# EasyEDA Pro project RC Transmitter Mini.epro

# Schematic V2
Board Name: Board1; Create Date: 2025-03-20; Page Name: V2; Project Name: RC Transmitter V2; Schematic Name: V2; Update Date: 2025-03-20; Company: EasyEDA.com; Page Size: A4; Version: V1.0
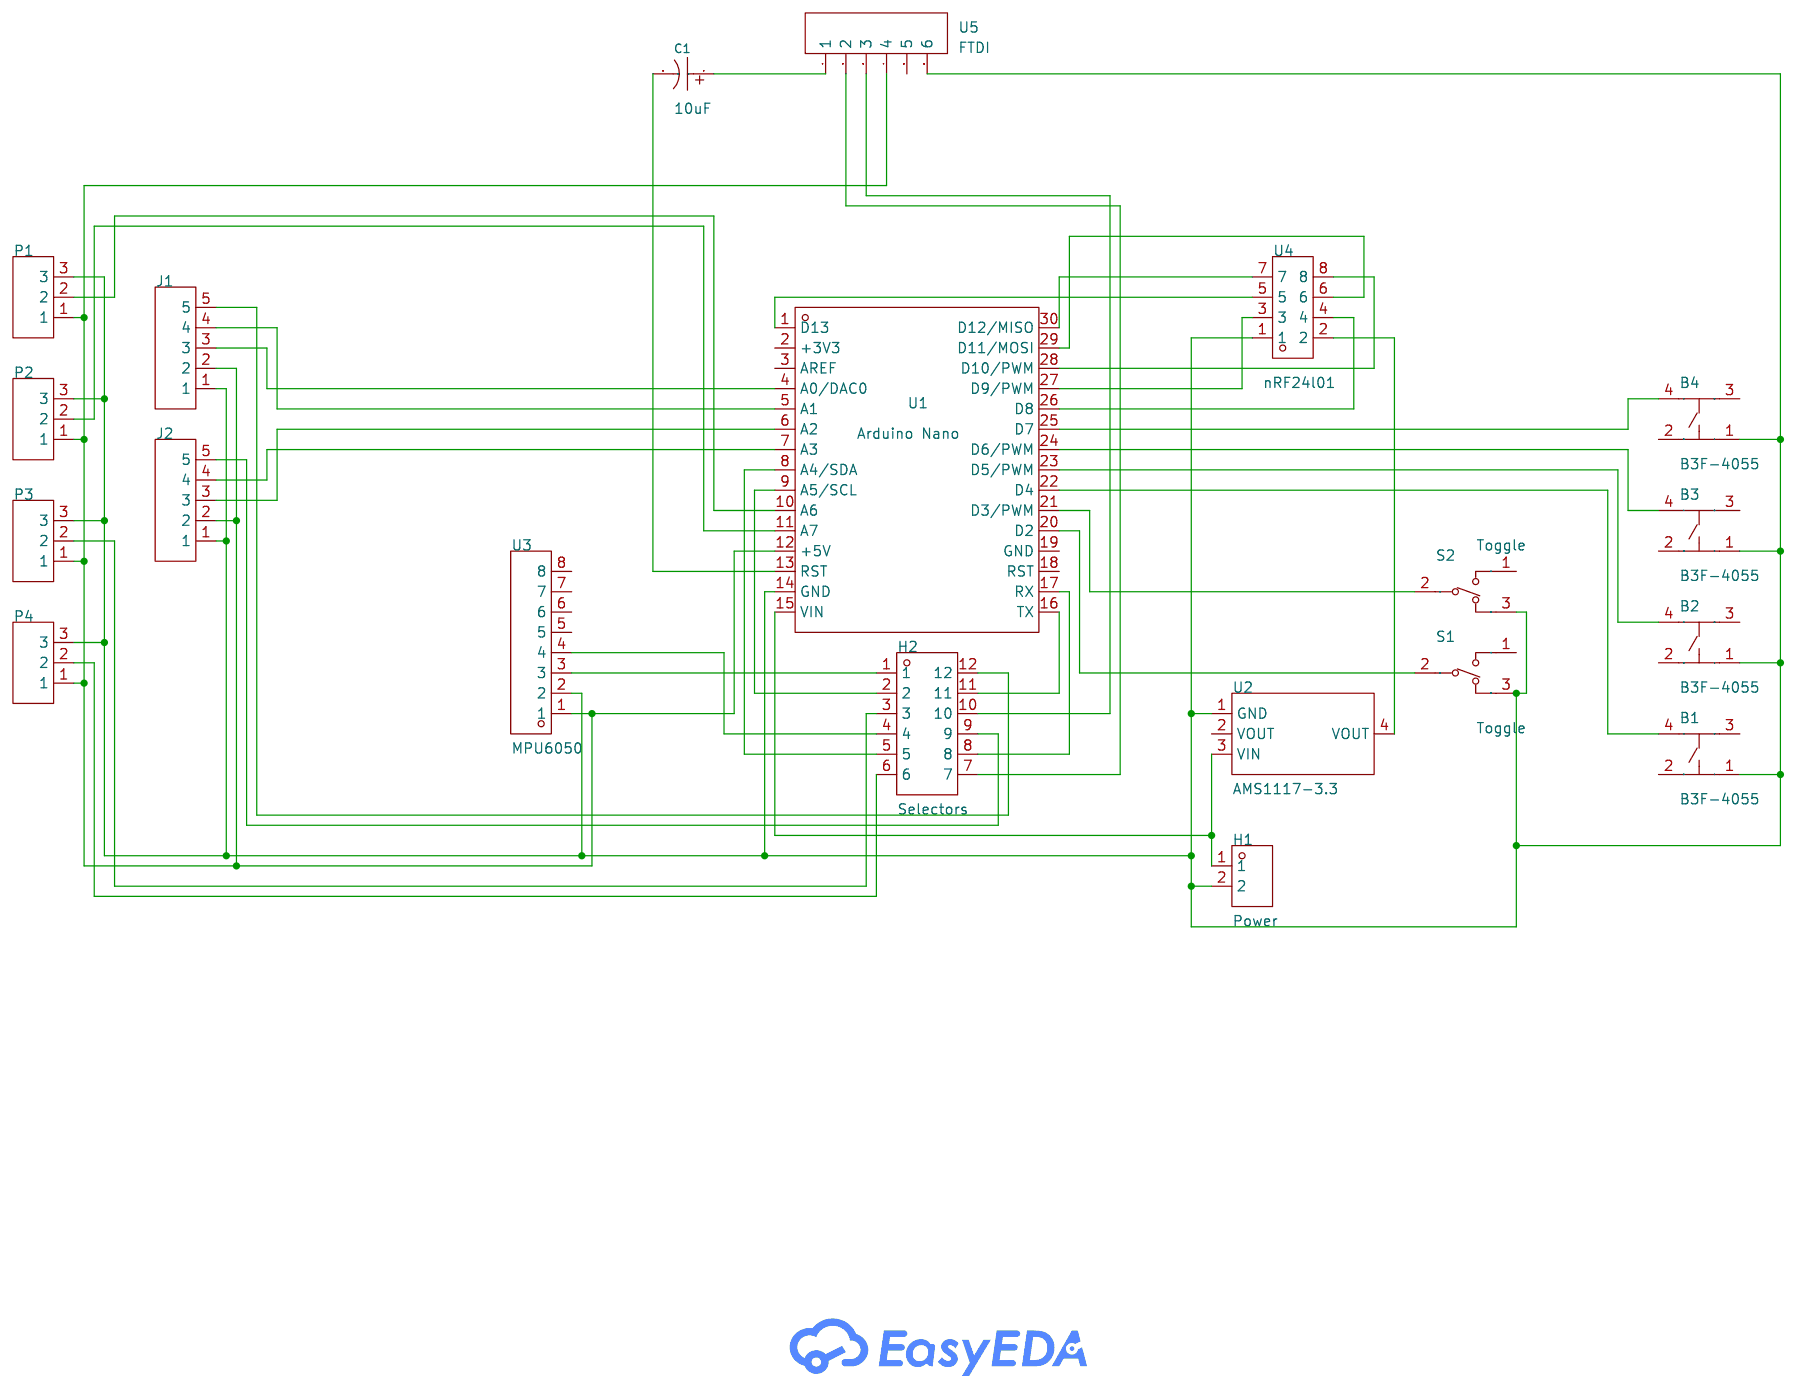
[diagram p0: schematic sheet]

## Parts
B1  B3F-4055  [KEY-TH_4P-L12.0-W12.0-P5.00-LS13.4-EH]
B2  B3F-4055  [KEY-TH_4P-L12.0-W12.0-P5.00-LS13.4-EH]
B3  B3F-4055  [KEY-TH_4P-L12.0-W12.0-P5.00-LS13.4-EH]
B4  B3F-4055  [KEY-TH_4P-L12.0-W12.0-P5.00-LS13.4-EH]
C1  10uF  [CAP-TH_BD5.0-P2.00-D0.8-FD]
H1  Power  [HDR-TH_2P-P2.54-V-M_5]
H2  Selectors  [HDR-TH_12P-P2.54-V-M-R3-C4-S2.54]
J1  HB-PH3-25415PB2GOP  [HDR-TH_5P-P2.54-V-M]
J2  HB-PH3-25415PB2GOP  [HDR-TH_5P-P2.54-V-M]
P1  PZ254V-11-03P  [HDR-TH_3P-P2.54-V-M]
P2  PZ254V-11-03P  [HDR-TH_3P-P2.54-V-M]
P3  PZ254V-11-03P  [HDR-TH_3P-P2.54-V-M]
P4  PZ254V-11-03P  [HDR-TH_3P-P2.54-V-M]
S1  Toggle  [SW-TH_ST-0-103-A01]
S2  Toggle  [SW-TH_ST-0-103-A01]
U1  Arduino Nano  [MOD-TH_ABX00028]
U2  AMS1117-3.3  [SOT-223-3_L6.5-W3.4-P2.30-LS7.0-BR]
U3  MPU6050  [HDR-TH_8P-P2.54-V-F]
U4  nRF24l01  [HDR-TH_8P-P2.54-V-F-R2-C4-S2.54]
U5  FTDI  [HDR-TH_6P-P2.54-V-M-1]

## Library data of the parts
B1-B4 = B3F-4055_C84931: Circuit:SPST Actuator Style:Rectangle button Mounting Style:Direct Insert Switch Length:12mm Switch Width:12mm Switch Height:7.3mm Contact Current:50mA Voltage Rating (DC):24V With Lamp:- Mechanical Life:-; LCSC Part Name: 12*12*7.3mm 直插 轻触开关; Supplier Part: C84931; Manufacturer: OMRON(欧姆龙); Supplier Footprint: 插件; JLCPCB Part Class: Extended Part; Datasheet: https://atta.szlcsc.com/upload/public/pdf/source/20170810/C93157_1502335414592880008.pdf; Supplier: LCSC; Circuit: SPST; Actuator Style: Rectangle button; Mounting Style: Direct Insert; Switch Length: 12mm; Switch Width: 12mm; Switch Height: 7.3mm; Contact Current: 50mA; Voltage Rating (DC): 24V
C1 = RD1H106M05011PC: Capacitance: Tolerance:±20% Tolerance:±20% Rated Voltage: Ripple Current:- Equivalent Series Resistance(ESR):- Lead Spacing: φD: L: Lifetime @ Temp:1000hrs@105℃; LCSC Part Name: 10uF ±20% 50V; Supplier Part: C160624; Manufacturer: SAMWHA(三和); Supplier Footprint: 插件,D5xL11mm; JLCPCB Part Class: Extended Part; Datasheet: https://atta.szlcsc.com/upload/public/pdf/source/20171212/C160624_15130639695151177990.pdf; Supplier: LCSC; Tolerance: ±20%; Lifetime @ Temp: 1000hrs@105℃
H1 = PZ254-1-02-Z-C: Pin Structure:1x2P Pitch:2.54mm Row Spacing:- Circluar Pins/Square Pins:Circular Pins Mounting Type:Straight Number of Rows:Plugin Number of Pins:2P Current Rating (Max):3A Length of Mating Pin:4.13mm Insulation Height:3mm Length of End Connection Pin:3mm; LCSC Part Name: 1x2P 间距:2.54mm 圆针 直插; Supplier Part: C5156429; Manufacturer: HCTL(华灿天禄); Supplier Footprint: 插件,P=2.54mm; JLCPCB Part Class: Extended Part; Datasheet: https://atta.szlcsc.com/upload/public/pdf/source/20230609/791AB95BE9F63E00E86E05F9E750B3EF.pdf; Supplier: LCSC; Pin Structure: 1x2P; Pitch: 2.54mm; Circluar Pins/Square Pins: Circular Pins; Mounting Type: Straight; Number of Rows: Plugin; Number of Pins: 2P; Current Rating (Max): 3A; Length of Mating Pin: 4.13mm; Insulation Height: 3mm; Length of End Connection Pin: 3mm; Contact Plating: Gold; Operating Temperature Range: -40℃~+105℃; Soldering Temperature(Max): 260℃@10S; Color: Black
H2 = HX PZ2.54-3x4P ZZ: Pin Structure:3x4P Pitch:2.54mm Row Spacing:2.54mm Circluar Pins/Square Pins:Policy Mounting Type:Direct Insert Number of Rows:Triple row Number of Pins:12P Current Rating (Max):3A Voltage Rating (Max):- Length of Mating Pin:6mm Insulation Height:2.5mm Le; LCSC Part Name: 3x4P 间距:2.54mm 方针 直插; Supplier Part: C32713291; Manufacturer: hanxia(韩下); Supplier Footprint: 插件,P=2.54mm; JLCPCB Part Class: Extended Part; Datasheet: https://atta.szlcsc.com/upload/public/pdf/source/20240723/03D5BD78F4265407C742BB8D20821E6B.pdf; Supplier: LCSC; Pin Structure: 3x4P; Pitch: 2.54mm; Row Spacing: 2.54mm; Circluar Pins/Square Pins: Policy; Mounting Type: Direct Insert; Number of Rows: Triple row; Number of Pins: 12P; Current Rating (Max): 3A; Length of Mating Pin: 6mm; Insulation Height: 2.5mm; Length of End Connection Pin: 3mm; Contact Material: Brass; Contact Plating: Gold; Operating Temperature Range: -40℃~+105℃; Color: Black
J1 J2 = HB-PH3-25415PB2GOP: Pin Structure:1x5P Pitch:2.54mm Row Spacing:2.54mm Circluar Pins/Square Pins:Policy Mounting Type:Straight Number of Rows:Single Row Number of Pins:5P Current Rating:3A Voltage Rating (Max):250V Length of Mating Pin:6mm Insulation Height:2.54mm Length of; LCSC Part Name: 1x5P 间距:2.54mm 方针 直插; Supplier Part: C6332198; Manufacturer: HANBO(汉博); Supplier Footprint: 插件,P=2.54mm; JLCPCB Part Class: Extended Part; Datasheet: https://atta.szlcsc.com/upload/public/pdf/source/20230803/F72D259687963761DF1B552F3BB84A31.pdf; Supplier: LCSC; Pin Structure: 1x5P; Pitch: 2.54mm; Row Spacing: 2.54mm; Circluar Pins/Square Pins: Policy; Mounting Type: Straight; Number of Rows: Single Row; Number of Pins: 5P; Current Rating: 3A; Voltage Rating (Max): 250V; Length of Mating Pin: 6mm; Insulation Height: 2.54mm; Length of End Connection Pin: 3mm; Contact Material: Brass; Contact Plating: Gold; Operating Temperature: -40℃~+105℃; Color: Black
P1-P4 = PZ254V-11-03P: Pin Structure:1x3P Pitch:2.54mm Row Spacing:- Circluar Pins/Square Pins:Policy Mounting Type:Straight Number of Rows:Single Row Number of Pins:3P Current Rating:3A Voltage Rating (Max):250V Length of Mating Pin:6mm Insulation Height:2.5mm Length of End Co; LCSC Part Name: 1x3P 间距:2.54mm 方针 直插; Supplier Part: C2937625; Manufacturer: XFCN(兴飞); Supplier Footprint: 插件,P=2.54mm; JLCPCB Part Class: Extended Part; Datasheet: https://atta.szlcsc.com/upload/public/pdf/source/20200309/C492402_8335C3D49C4E4C618838D59BB1D024C1.pdf; Supplier: LCSC; Pin Structure: 1x3P; Pitch: 2.54mm; Circluar Pins/Square Pins: Policy; Mounting Type: Straight; Number of Rows: Single Row; Number of Pins: 3P; Current Rating: 3A; Voltage Rating (Max): 250V; Length of Mating Pin: 6mm; Insulation Height: 2.5mm; Length of End Connection Pin: 3mm; Operating Temperature: -40℃~+105℃; Color: Black
S1 S2 = ST-0-103-A01-T000-RS: Circuit:Single Pole Double Throw (SPDT) Switch Length:8.3mm Switch Width:5.2mm Switch Height:23.6mm Mechanical Life:- Contact Current:3A Voltage Rating (AC):125V Actuator Type:Cylinder knob Pin Style:Solder Mounting Style:Direct Insert Operating Temperatu; LCSC Part Name: 超小型钮子三脚三档 五件套 含配件; Supplier Part: C1788488; Manufacturer: YUEN FUNG(源丰); Supplier Footprint: 插件; JLCPCB Part Class: Extended Part; Datasheet: https://atta.szlcsc.com/upload/public/pdf/source/20230720/34A1F41796E6F2C5E358D19C4AAA567D.pdf; Supplier: LCSC; Circuit: Single Pole Double Throw (SPDT); Switch Length: 8.3mm; Switch Width: 5.2mm; Switch Height: 23.6mm; Contact Current: 3A; Voltage Rating (AC): 125V; Actuator Type: Cylinder knob; Pin Style: Solder; Mounting Style: Direct Insert; Operating Temperature: -25℃~+85℃
U1 = ABX00028: Supplier Part: C21303176; Manufacturer: arduino; Datasheet: https://atta.szlcsc.com/upload/public/pdf/source/20240516/DBE20BC6A27351D8B1B352A6E0678D57.pdf; Supplier: LCSC
U2 = AMS1117-3.3_C6186: Output Type:Fixed Voltage - Supply:- Output Voltage:3.3V Output Voltage:3.3V Output Current:1A Power Supply Rejection Ratio (PSRR):72dB@(120Hz) Voltage Dropout:1.3V@(800mA) standby current:- Noise:- Features:Overcurrent Protection(OCP)；Thermal Protection(; LCSC Part Name: 输出3.3V 1A; Supplier Part: C6186; Manufacturer: AMS; Supplier Footprint: SOT-223; JLCPCB Part Class: Basic Part; Datasheet: https://atta.szlcsc.com/upload/public/pdf/source/20180727/C6186_7A095716F0823C02F1997A905E26C086.pdf; Supplier: LCSC; Output Type: Fixed; Output Voltage: 3.3V; Output Current: 1A; Power Supply Rejection Ratio (PSRR): 72dB@(120Hz); Voltage Dropout: 1.3V@(800mA); Features: Overcurrent Protection(OCP)；Thermal Protection(TSD); Output Configuration: Positive electrode; Number of Outputs: 1
U3 = KH-2.54FH-1X8P-H8.5: Holes Structure:1x8P Pitch:2.54mm Row Spacing:- Circular Hole / Square Hole:Square Holes Mounting Type:Straight Number of Rows:Plugin Number of Holes:8P Current Rating (Max):3A Voltage Rating (Max):- Holes Direction:Top Insulation Height:8.5mm Operating T; LCSC Part Name: 间距:2.54mm 1x8P 直插; Supplier Part: C2905417; Manufacturer: kinghelm(金航标); Supplier Footprint: 插件,P=2.54mm; JLCPCB Part Class: Extended Part; Datasheet: https://atta.szlcsc.com/upload/public/pdf/source/20211019/4EE60A4A588681C04A5AE3F1D2563204.pdf; Supplier: LCSC; Holes Structure: 1x8P; Pitch: 2.54mm; Circular Hole / Square Hole: Square Holes; Mounting Type: Straight; Number of Rows: Plugin; Number of Holes: 8P; Current Rating (Max): 3A; Holes Direction: Top; Insulation Height: 8.5mm; Operating Temperature Range: -40℃~+105℃
U4 = 2.54-2*4: Holes Structure:2x4P Pitch:2.54mm Row Spacing:2.54mm Circular Hole / Square Hole:Square Holes Mounting Type:Straight Number of Rows:双排 Number of Holes:8P Current Rating (Max):2.5A Voltage Rating (Max):- Holes Direction:Top Insulation Height:8.5mm Operatin; LCSC Part Name: 间距:2.54mm 2x4P 直插; Supplier Part: C2977588; Manufacturer: ZHOURI(洲日); Supplier Footprint: 插件,P=2.54mm; JLCPCB Part Class: Extended Part; Datasheet: https://atta.szlcsc.com/upload/public/pdf/source/20220328/363EB391BC0EB759CF231FC910753CBE.pdf; Supplier: LCSC; Holes Structure: 2x4P; Pitch: 2.54mm; Row Spacing: 2.54mm; Circular Hole / Square Hole: Square Holes; Mounting Type: Straight; Number of Rows: 双排; Number of Holes: 8P; Current Rating (Max): 2.5A; Holes Direction: Top; Insulation Height: 8.5mm; Operating Temperature Range: -40℃~+105℃
U5 = 2.54-1x6P直针: Pin Structure:1x6P Pitch:2.54mm Row Spacing:- Circluar Pins/Square Pins:Square Pins Mounting Type:Straight Number of Rows:Plugin Number of Pins:6P Current Rating (Max):3A Voltage Rating (Max):- Length of Mating Pin:- Insulation Height:- Contact Material:; LCSC Part Name: 间距:2.54mm 1x6P 直插 方针; Supplier Part: C37208; Manufacturer: BOOMELE(博穆精密); Supplier Footprint: 插件,P=2.54mm; JLCPCB Part Class: Extended Part; Supplier: LCSC; Pin Structure: 1x6P; Pitch: 2.54mm; Circluar Pins/Square Pins: Square Pins; Mounting Type: Straight; Number of Rows: Plugin; Number of Pins: 6P; Current Rating (Max): 3A; Operating Temperature Range: -40℃~+105℃; Color: Black

## Nets
Net-(B1-1): B1.1 B2.1 B3.1 B4.1 H1.2 J1.1 J2.1 P1.3 P2.3 P3.3 P4.3 S1.3 S2.3 U1.14(GND) U2.1(GND) U3.2 U4.1 U5.6
Net-(B1-4): B1.4 U1.22(D4)
Net-(B2-4): B2.4 U1.23(D5/PWM)
Net-(B3-4): B3.4 U1.24(D6/PWM)
Net-(B4-4): B4.4 U1.25(D7)
Net-(C1-1): C1.1 U5.1
Net-(C1-2): C1.2 U1.13(RST)
Net-(H1-1): H1.1 U1.15(VIN) U2.3(VIN)
Net-(H2-1): H2.1 U3.3
Net-(H2-2): H2.2 U1.9(A5/SCL)
Net-(H2-3): H2.3 P3.2
Net-(H2-4): H2.4 U3.4
Net-(H2-5): H2.5 U1.8(A4/SDA)
Net-(H2-6): H2.6 P4.2
Net-(H2-7): H2.7 U5.2
Net-(H2-8): H2.8 U1.17(RX)
Net-(H2-9): H2.9 J2.5
Net-(H2-10): H2.10 U5.3
Net-(H2-11): H2.11 U1.16(TX)
Net-(H2-12): H2.12 J1.5
Net-(J1-2): J1.2 J2.2 P1.1 P2.1 P3.1 P4.1 U1.12(+5V) U3.1 U5.4
Net-(J1-3): J1.3 U1.4(A0/DAC0)
Net-(J1-4): J1.4 U1.5(A1)
Net-(J2-3): J2.3 U1.6(A2)
Net-(J2-4): J2.4 U1.7(A3)
Net-(P1-2): P1.2 U1.10(A6)
Net-(P2-2): P2.2 U1.11(A7)
Net-(S1-2): S1.2 U1.20(D2)
Net-(S2-2): S2.2 U1.21(D3/PWM)
Net-(U1-1): U1.1(D13) U4.5
Net-(U1-26): U1.26(D8) U4.4
Net-(U1-27): U1.27(D9/PWM) U4.3
Net-(U1-28): U1.28(D10/PWM) U4.8
Net-(U1-29): U1.29(D11/MOSI) U4.6
Net-(U1-30): U1.30(D12/MISO) U4.7
Net-(U2-4): U2.4(VOUT) U4.2

Not connected (* = marked no-connect by the designer): B1 2 3; B2 2 3; B3 2 3; B4 2 3; S1 1; S2 1; U1 2(+3V3) 3(AREF) 18(RST) 19(GND); U2 2(VOUT); U3 5 6 7 8; U5 5

# Board PCB
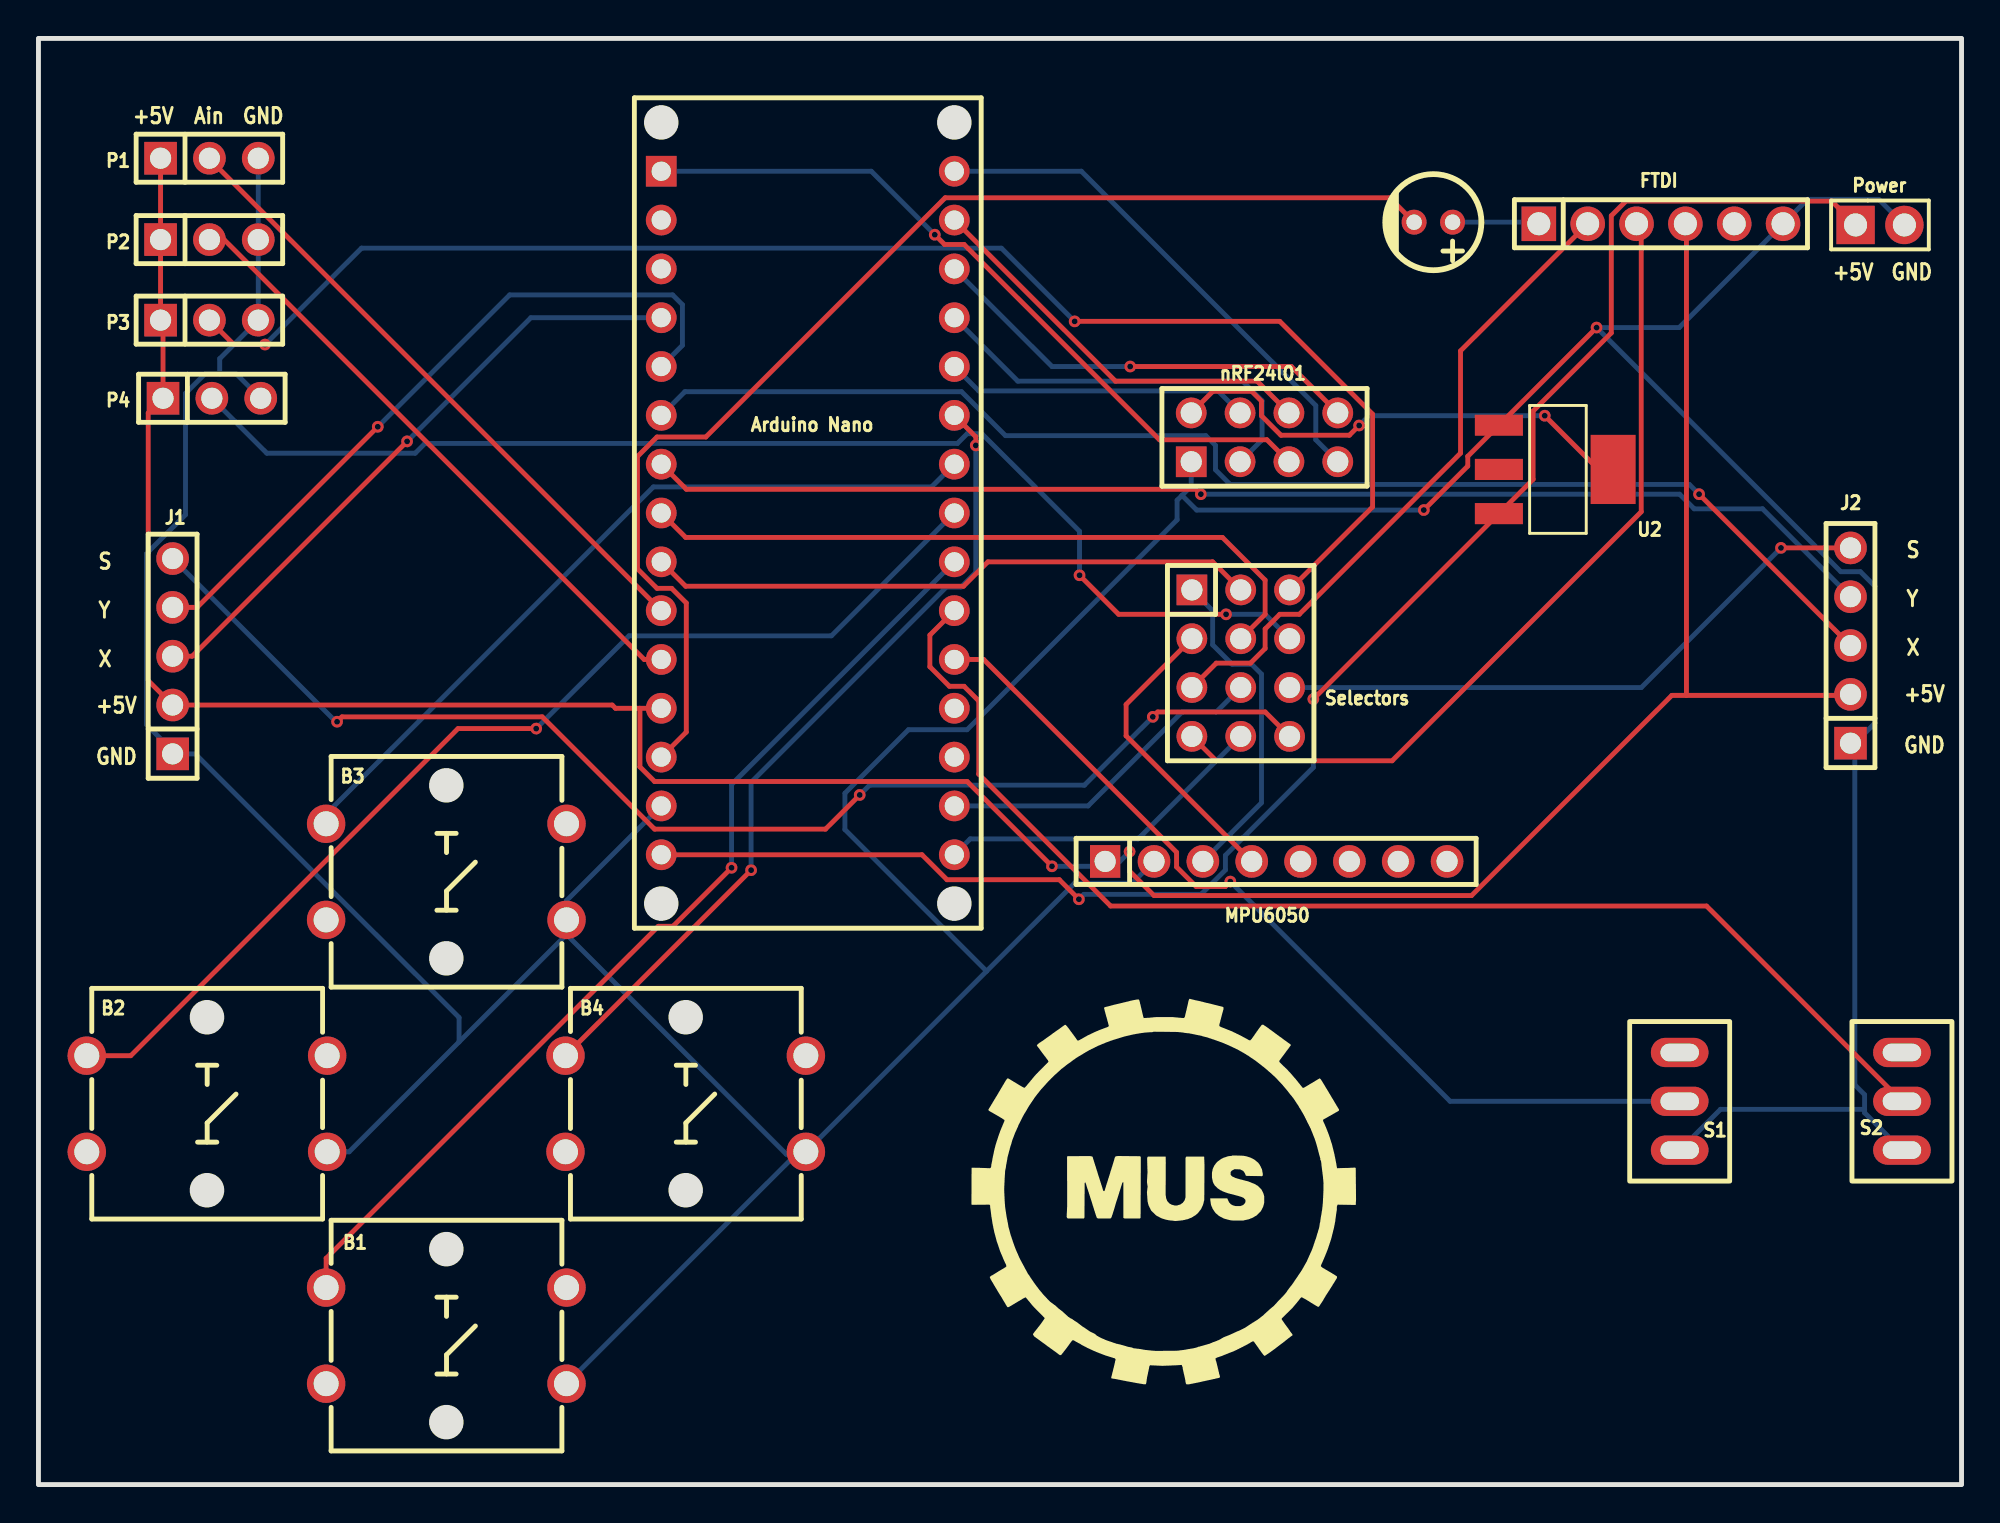
[diagram p1: board, top side]
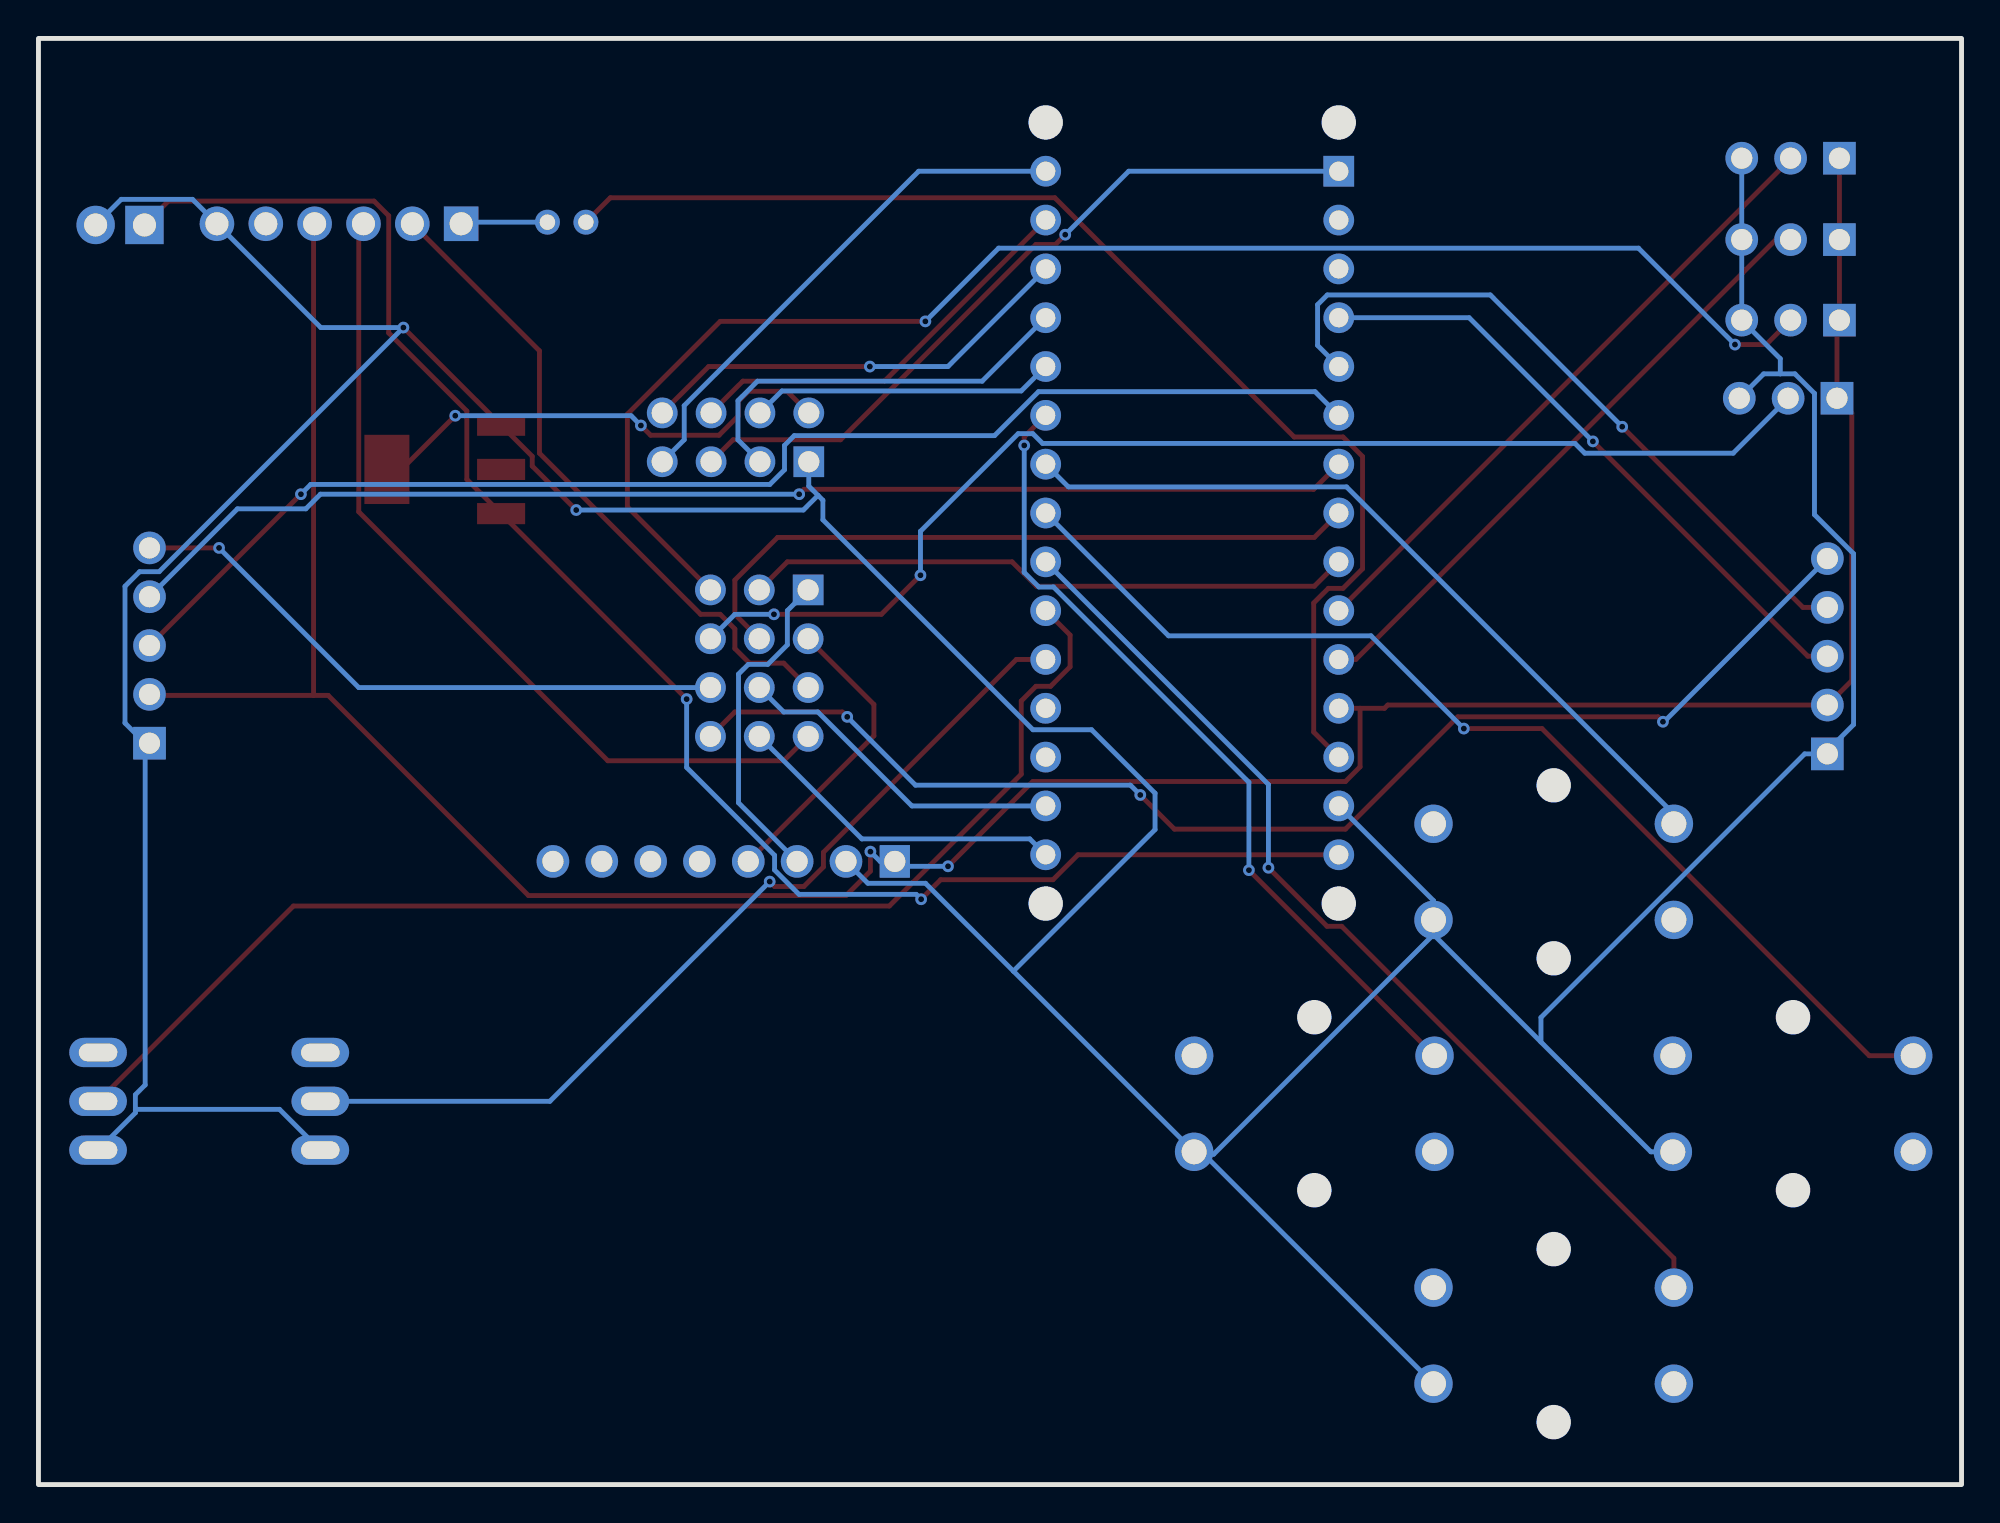
[diagram p2: board, bottom side, seen from below]

Outline 100 x 75.23 mm; copper layers: Top Layer, Bottom Layer. Coordinates in mm from the lower left corner of the outline.
Outline path: rectangle 0,75.23 100,0
Stack: Top Layer 0.035mm / Dielectric1 1.51mm FR4 er 4.5 / Bottom Layer 0.035mm

## Design rules (mm)
template: JLCPCB Capability(Two Layers Board)
spacing copperThickness1oz (default): track to track 0.102, other pairs 0.152 to 0.3
spacing copperThickness2oz: track to track 0.203, other pairs 0.152 to 0.3
track width copperThickness1oz (default): min 0.127, default 0.254, max 2.54
track width copperThickness2oz: min 0.203, default 0.254, max 2.54
differential pair differentialPair (default): width min 0.127, default 0.254, max 2.54; gap min 0.152, default 0.152
via viaSize (default): diameter min 0.5, default 0.61, max 10; hole min 0.3, default 0.305, max 6.3

## Placement (name value [footprint] x y rotation side)
Arduino Nano  Arduino Nano  [MOD-TH_ABX00028]  40 50.55 0 top
B1  B3F-4055  [KEY-TH_4P-L12.0-W12.0-P5.00-LS13.4-EH]  21.21 7.75 0 top
B2  B3F-4055  [KEY-TH_4P-L12.0-W12.0-P5.00-LS13.4-EH]  8.76 19.81 0 top
B3  B3F-4055  [KEY-TH_4P-L12.0-W12.0-P5.00-LS13.4-EH]  21.21 31.88 0 top
B4  B3F-4055  [KEY-TH_4P-L12.0-W12.0-P5.00-LS13.4-EH]  33.66 19.81 0 top
C1  10uF  [CAP-TH_BD5.0-P2.00-D0.8-FD]  72.53 65.68 180 top
FTDI  FTDI  [HDR-TH_6P-P2.54-V-M-1]  84.37 65.59 0 top
J1  HB-PH3-25415PB2GOP  [HDR-TH_5P-P2.54-V-M]  6.98 43.09 90 top
J2  HB-PH3-25415PB2GOP  [HDR-TH_5P-P2.54-V-M]  94.23 43.65 90 top
MPU6050  MPU6050  [HDR-TH_8P-P2.54-V-F]  64.36 32.42 0 top
nRF24l01  nRF24l01  [HDR-TH_8P-P2.54-V-F-R2-C4-S2.54]  63.75 54.48 0 top
P1  PZ254V-11-03P  [HDR-TH_3P-P2.54-V-M]  8.89 69 0 top
P2  PZ254V-11-03P  [HDR-TH_3P-P2.54-V-M]  8.89 64.77 0 top
P3  PZ254V-11-03P  [HDR-TH_3P-P2.54-V-M]  8.89 60.58 0 top
P4  PZ254V-11-03P  [HDR-TH_3P-P2.54-V-M]  9.02 56.52 0 top
Power  Power  [HDR-TH_2P-P2.54-V-M_5]  95.76 65.53 0 top
S1  Toggle  [SW-TH_ST-0-103-A01]  85.34 19.94 270 top
S2  Toggle  [SW-TH_ST-0-103-A01]  96.9 19.94 270 top
Selectors  Selectors  [HDR-TH_12P-P2.54-V-M-R3-C4-S2.54]  62.52 42.73 270 top
U2  AMS1117-3.3  [SOT-223-3_L6.5-W3.4-P2.30-LS7.0-BR]  78.91 52.81 180 top

## Footprints (pads in the part's own frame, mm; a bottom-side part is the same pattern mirrored in y, then rotated)
CAP-TH_BD5.0-P2.00-D0.8-FD
  round 1.3 hole 0.8: 1(-1,0) 2(1,0)
HDR-TH_2P-P2.54-V-M_5
  rect 2x2 hole 1.2: 1(-1.27,0)
  round 2 hole 1.2: 2(1.27,0)
HDR-TH_3P-P2.54-V-M
  rect 1.7x1.7 hole 1.1: 1(-2.54,0)
  round 1.7 hole 1.1: 2(0,0) 3(2.54,0)
HDR-TH_5P-P2.54-V-M
  rect 1.7x1.7 hole 1.1: 1(-5.08,0)
  round 1.7 hole 1.1: 2(-2.54,0) 3(0,0) 4(2.54,0) 5(5.08,0)
HDR-TH_6P-P2.54-V-M-1
  rect 1.8x1.8 hole 1.2: 1(-6.35,0)
  round 1.8 hole 1.2: 2(-3.81,0) 3(-1.27,0) 4(1.27,0) 5(3.81,0) 6(6.35,0)
HDR-TH_8P-P2.54-V-F
  rect 1.575x1.7 hole 1.1: 1(-8.89,0)
  round 1.7 hole 1.1: 2(-6.35,0) 3(-3.81,0) 4(-1.27,0) 5(1.27,0) 6(3.81,0) 7(6.35,0) 8(8.89,0)
HDR-TH_8P-P2.54-V-F-R2-C4-S2.54
  rect 1.6x1.6 hole 1.1: 1(-3.81,-1.27)
  round 1.6 hole 1.1: 2(-3.81,1.27) 3(-1.27,-1.27) 4(-1.27,1.27) 5(1.27,-1.27) 6(1.27,1.27) 7(3.81,-1.27) 8(3.81,1.27)
HDR-TH_12P-P2.54-V-M-R3-C4-S2.54
  rect 1.6x1.6 hole 1.1: 1(-3.81,-2.54)
  round 1.6 hole 1.1: 2(-3.81,0) 3(-3.81,2.54) 4(-1.27,-2.54) 5(-1.27,0) 6(-1.27,2.54) 7(1.27,-2.54) 8(1.27,0) 9(1.27,2.54) 10(3.81,-2.54) 11(3.81,0) 12(3.81,2.54)
KEY-TH_4P-L12.0-W12.0-P5.00-LS13.4-EH
  round 2 hole 1.3: 1(6.25,-2.5) 2(-6.25,-2.5) 3(6.25,2.5) 4(-6.25,2.5)
MOD-TH_ABX00028
  rect 1.6x1.6 hole 1: 1(-7.62,17.78)
  round 1.6 hole 1: 2(-7.62,15.24) 3(-7.62,12.7) 4(-7.62,10.16) 5(-7.62,7.62) 6(-7.62,5.08) 7(-7.62,2.54) 8(-7.62,0) 9(-7.62,-2.54) 10(-7.62,-5.08) 11(-7.62,-7.62) 12(-7.62,-10.16) 13(-7.62,-12.7) 14(-7.62,-15.24) 15(-7.62,-17.78) 16(7.62,-17.78) 17(7.62,-15.24) 18(7.62,-12.7) 19(7.62,-10.16) 20(7.62,-7.62) 21(7.62,-5.08) 22(7.62,-2.54) 23(7.62,0) 24(7.62,2.54) 25(7.62,5.08) 26(7.62,7.62) 27(7.62,10.16) 28(7.62,12.7) 29(7.62,15.24) 30(7.62,17.78)
SOT-223-3_L6.5-W3.4-P2.30-LS7.0-BR
  rect 2.5x1.1 smd: 1(2.97,-2.3) 2(2.97,0) 3(2.97,2.3)
  rect 2.34x3.6 smd: 4(-2.97,0)
SW-TH_ST-0-103-A01
  oval 1.524x3 hole 0.914x2: 1(-2.54,0) 2(0,0) 3(2.54,0)

## Nets
$1N1105: Arduino Nano.15 Power.1 U2.3
$1N1106: nRF24l01.2 U2.4
$1N1107: Arduino Nano.26 nRF24l01.4
$1N1108: Arduino Nano.16 Selectors.11
$1N1109: Arduino Nano.17 Selectors.8
$1N1110: Arduino Nano.9 Selectors.2
$1N1111: Arduino Nano.8 Selectors.5
$1N1112: MPU6050.3 Selectors.1
$1N1113: MPU6050.4 Selectors.4
$1N1115: Arduino Nano.4 J1.3
$1N1116: Arduino Nano.5 J1.4
$1N1117: Arduino Nano.6 J2.3
$1N1118: Arduino Nano.7 J2.4
$1N1119: J2.5 Selectors.9
$1N1120: J1.5 Selectors.12
$1N1121: Arduino Nano.20 S1.2
$1N1122: Arduino Nano.21 S2.2
$1N1124: Arduino Nano.10 P1.2
$1N1125: Arduino Nano.11 P2.2
$1N1126: P4.2 Selectors.6
$1N1127: P3.2 Selectors.3
$1N1129: Arduino Nano.1 nRF24l01.5
$1N1130: Arduino Nano.27 nRF24l01.3
$1N1131: Arduino Nano.30 nRF24l01.7
$1N1132: Arduino Nano.29 nRF24l01.6
$1N1133: Arduino Nano.28 nRF24l01.8
$1N1134: Arduino Nano.25 B4.4
$1N1135: Arduino Nano.24 B3.4
$1N1136: Arduino Nano.23 B2.4
$1N1137: Arduino Nano.22 B1.4
$1N1138: C1.1 FTDI.1
$1N1139: Arduino Nano.13 C1.2
$1N1140: FTDI.3 Selectors.10
$1N1141: FTDI.2 Selectors.7
$1N2204: Arduino Nano.14 B1.1 B2.1 B3.1 B4.1 FTDI.6 J1.1 J2.1 MPU6050.2 nRF24l01.1 P1.3 P2.3 P3.3 P4.3 Power.2 S1.3 S2.3 U2.1
$1N2235: Arduino Nano.12 FTDI.4 J1.2 J2.2 MPU6050.1 P1.1 P2.1 P3.1 P4.1

Pads without a net: Arduino Nano 2 3 18 19; B1 2 3; B2 2 3; B3 2 3; B4 2 3; FTDI 5; MPU6050 5 6 7 8; S1 1; S2 1; U2 2

## Via types
v1: diameter 0.61, hole 0.305, Top Layer to Bottom Layer, 27 vias

## Routing (per net, layer and track width the routed paths; a pad name or vN(x,y) marks a point on that pad's centre or on a via; arc(x,y) is an arc through that point)
$1N1105: length 86.8
  Top Layer w0.254: v1(66.29,40.86) U2.3 77.72,52.3 77.72,55.85 81.79,59.92 81.79,66.01 82.55,66.77 93.25,66.77 Power.1 ; v1(54.1,30.45) 53.09,31.47 47.24,31.47 45.94,32.77 Arduino Nano.15
  Bottom Layer w0.254: v1(54.1,30.45) 54.36,30.7 60.45,30.7 61.72,31.97 61.72,32.74 66.29,37.31 v1(66.29,40.86)
$1N1106: length 25.4
  Top Layer w0.254: nRF24l01.2 61.07,56.88 63.09,56.88 63.59,56.37 63.59,55.61 64.61,54.59 68.17,54.59 v1(68.67,55.1) ; v1(78.33,55.61) 81.12,52.81 U2.4
  Bottom Layer w0.254: v1(68.67,55.1) 69.18,55.61 v1(78.33,55.61)
$1N1107: length 15.9
  Bottom Layer w0.254: Arduino Nano.26 48.9,56.9 61.34,56.9 nRF24l01.4
$1N1108: length 17.4
  Bottom Layer w0.254: Arduino Nano.16 48.45,33.59 57.18,33.59 Selectors.11
$1N1109: length 17.4
  Bottom Layer w0.254: Selectors.8 61.25,40.19 59.47,40.19 54.58,35.31 Arduino Nano.17
$1N1110: length 31.8
  Top Layer w0.254: Arduino Nano.9 33.66,46.74 48.1,46.74 49.37,48.01 61.06,48.01 Selectors.2
$1N1111: length 36.4
  Top Layer w0.254: Arduino Nano.8 33.66,49.28 61.56,49.28 63.79,47.05 63.79,45.28 Selectors.5
$1N1112: length 17.5
  Bottom Layer w0.254: MPU6050.3 63.6,35.47 63.6,42.16 63.09,42.67 62.07,42.67 61.06,43.69 61.06,45.47 Selectors.1
$1N1113: length 15.7
  Top Layer w0.254: Selectors.4 56.56,40.58 56.56,38.95 MPU6050.4
$1N1115: length 32.7
  Top Layer w0.254: v1(19.17,54.27) 7.99,43.09 J1.3
  Bottom Layer w0.254: v1(19.17,54.27) 25.6,60.71 Arduino Nano.4
$1N1116: length 37.1
  Top Layer w0.254: v1(17.64,55.03) 8.25,45.64 J1.4
  Bottom Layer w0.254: Arduino Nano.5 33.49,59.27 33.49,61.38 32.98,61.89 24.5,61.89 v1(17.64,55.03)
$1N1117: length 68.6
  Top Layer w0.254: J2.3 v1(86.35,51.52)
  Bottom Layer w0.254: Arduino Nano.6 33.62,56.86 48,56.86 50.28,54.57 60.7,54.57 61.21,54.06 61.21,52.79 61.97,52.03 85.84,52.03 v1(86.35,51.52)
$1N1118: length 64.7
  Top Layer w0.254: Arduino Nano.7 33.69,51.78 60.19,51.78 v1(60.44,51.52)
  Bottom Layer w0.254: J2.4 89.65,50.76 86.1,50.76 85.34,51.52 v1(60.44,51.52)
$1N1119: length 32.2
  Top Layer w0.254: v1(90.61,48.73) J2.5
  Bottom Layer w0.254: v1(90.61,48.73) 83.35,41.47 Selectors.9
$1N1120: length 67.2
  Top Layer w0.254: Selectors.12 63.79,40.19 58.2,40.19 v1(57.95,39.94) ; v1(42.71,35.88) 40.93,34.1 32.04,34.1 26.2,39.94 15.78,39.94 v1(15.53,39.69)
  Bottom Layer w0.254: J1.5 15.46,39.69 v1(15.53,39.69) ; v1(42.71,35.88) 43.21,36.39 54.39,36.39 v1(57.95,39.94)
$1N1121: length 47.9
  Top Layer w0.254: v1(61.98,31.37) 61.72,31.11 60.2,31.11 59.18,32.13 59.18,32.89 49.15,42.93 Arduino Nano.20
  Bottom Layer w0.254: v1(61.98,31.37) 73.41,19.94 S1.2
$1N1122: length 65.6
  Top Layer w0.254: Arduino Nano.21 46.35,44.2 46.35,42.55 47.37,41.53 48.13,41.53 48.9,40.77 48.9,36.96 55.75,30.1 86.74,30.1 S2.2
$1N1124: length 33.3
  Top Layer w0.254: P1.2 8.89,68.96 Arduino Nano.10
$1N1125: length 32.5
  Top Layer w0.254: P2.2 9.65,64.77 31.5,42.93 Arduino Nano.11
$1N1126: length 63.4
  Top Layer w0.254: v1(54.14,47.31) 56.17,45.28 v1(61.76,45.28)
  Bottom Layer w0.254: Selectors.6 63.79,45.28 v1(61.76,45.28) ; v1(54.14,47.31) 54.14,49.59 49.06,54.67 48.29,54.67 47.79,54.17 20.1,54.17 19.59,53.66 11.88,53.66 P4.2
$1N1127: length 77.6
  Top Layer w0.254: v1(53.88,60.52) 64.55,60.52 69.38,55.69 69.38,50.86 Selectors.3 ; P3.2 10.16,59.31 v1(11.78,59.31)
  Bottom Layer w0.254: v1(11.78,59.31) 16.8,64.33 50.07,64.33 v1(53.88,60.52)
$1N1129: length 38.9
  Top Layer w0.254: 65.02,53.21 63.88,54.36 58.29,54.36 48.13,64.52 47.12,64.52 v1(46.61,65.02)
  Bottom Layer w0.254: v1(46.61,65.02) 43.31,68.33 Arduino Nano.1
$1N1130: length 21.4
  Bottom Layer w0.254: Arduino Nano.27 50.93,57.4 62.61,57.4 63.63,56.39 63.63,54.36 62.48,53.21
$1N1131: length 27.2
  Bottom Layer w0.254: 67.56,53.21 66.42,54.36 66.42,56.13 54.23,68.33 Arduino Nano.30
$1N1132: length 21.6
  Top Layer w0.254: Arduino Nano.29 56.01,57.4 63.37,57.4 nRF24l01.6
$1N1133: length 23
  Top Layer w0.254: v1(56.77,58.17) 65.15,58.17 nRF24l01.8
  Bottom Layer w0.254: Arduino Nano.28 52.71,58.17 v1(56.77,58.17)
$1N1134: length 43.1
  Top Layer w0.254: v1(48.74,54.06) 48.74,54.51 Arduino Nano.25 ; B4.4 v1(37.06,31.96)
  Bottom Layer w0.254: v1(48.74,54.06) 48.74,47.46 47.98,46.7 47.22,46.7 37.06,36.54 v1(37.06,31.96)
$1N1135: length 40.7
  Bottom Layer w0.254: Arduino Nano.24 46.44,51.9 31.98,51.9 14.96,34.89 B3.4
$1N1136: length 56.8
  Top Layer w0.254: v1(25.88,39.33) 21.82,39.33 4.8,22.31 B2.4
  Bottom Layer w0.254: Arduino Nano.23 41.24,44.16 30.71,44.16 v1(25.88,39.33)
$1N1137: length 51.7
  Top Layer w0.254: v1(36.04,32.09) 32.99,29.04 32.23,29.04 14.96,11.77 B1.4
  Bottom Layer w0.254: v1(36.04,32.09) 36.04,36.42 Arduino Nano.22
$1N1138: length 4.5
  Bottom Layer w0.254: FTDI.1 77.94,65.68 C1.1
$1N1139: length 64.2
  Top Layer w0.254: C1.2 70.26,66.95 47.15,66.95 34.7,54.5 32.16,54.5 31.15,53.48 31.15,47.64 32.16,46.63 32.93,46.63 33.69,45.86 33.69,39.15 Arduino Nano.13
$1N1140: length 44.3
  Top Layer w0.254: Selectors.10 61.25,37.66 70.39,37.66 83.35,50.61 83.35,65.35 FTDI.3
$1N1141: length 34.3
  Top Layer w0.254: Selectors.7 61.25,42.73 63.03,42.73 63.79,43.5 63.79,44.51 64.55,45.28 65.57,45.28 73.95,53.66 73.95,58.98 FTDI.2
$1N2204: length 289.1
  Top Layer w0.254: v1(72.04,50.7) 74.32,52.99 74.32,53.49 U2.1 v1(81.02,60.19)
  Bottom Layer w0.254: MPU6050.2 56.87,31.28 53.88,31.28 49.3,26.71 ; 94.96,19.52 87.47,19.52 85.34,17.4 ; 94.96,19.52 94.96,19.34 96.9,17.4 ; 94.96,19.52 94.96,20.28 94.45,20.79 94.45,38.57 ; 49.3,26.71 41.94,34.08 41.94,35.97 45.24,39.27 48.29,39.27 59.21,50.19 59.21,51.21 59.46,51.46 ; 49.3,26.71 B4.1 39.78,17.19 39.4,17.19 ; 27.46,28.61 38.89,17.19 39.4,17.19 ; 27.46,28.61 21.87,23.03 ; 27.46,28.61 B3.1 27.46,30.38 Arduino Nano.14 ; 7.14,38.01 8.16,38.01 21.87,24.3 21.87,23.03 ; 7.14,38.01 5.61,39.54 5.61,48.43 7.65,50.46 7.65,56.77 8.66,57.78 9.42,57.78 ; 7.14,38.01 J1.1 ; 9.42,57.78 9.42,58.57 P3.3 P2.3 P1.3 ; 9.42,57.78 10.29,57.78 P4.3 ; 21.87,23.03 16.16,17.31 B2.1 ; 39.4,17.19 B1.1 ; 94.45,38.57 95.5,39.62 95.5,46.73 94.74,47.49 93.72,47.49 v1(81.02,60.19) 85.32,60.19 FTDI.6 91.99,66.86 95.7,66.86 Power.2 ; 94.45,38.57 J2.1 ; 59.46,51.46 60.22,50.7 v1(72.04,50.7) ; 59.46,51.46 59.94,51.94 59.94,53.21
$1N2235: length 153.7
  Top Layer w0.254: v1(56.74,32.93) 56.74,31.91 58.01,30.64 74.52,30.64 84.93,41.06 85.69,41.06 ; v1(52.7,32.17) 48.29,36.58 32.04,36.58 31.28,37.34 31.28,40.39 ; 31.28,40.39 Arduino Nano.12 ; 31.28,40.39 30.01,40.39 29.84,40.56 6.98,40.56 5.71,41.83 5.71,55.75 P4.1 6.48,60.45 P3.1 P2.1 P1.1 ; 85.69,41.06 94.17,41.06 J2.2 ; 85.69,41.06 85.69,65.54 FTDI.4
  Bottom Layer w0.254: v1(52.7,32.17) 55.22,32.17 MPU6050.1 56.23,32.42 v1(56.74,32.93)

## Text on the board
Top Silkscreen Layer: +5V | GND | S | Y | X | Ain
